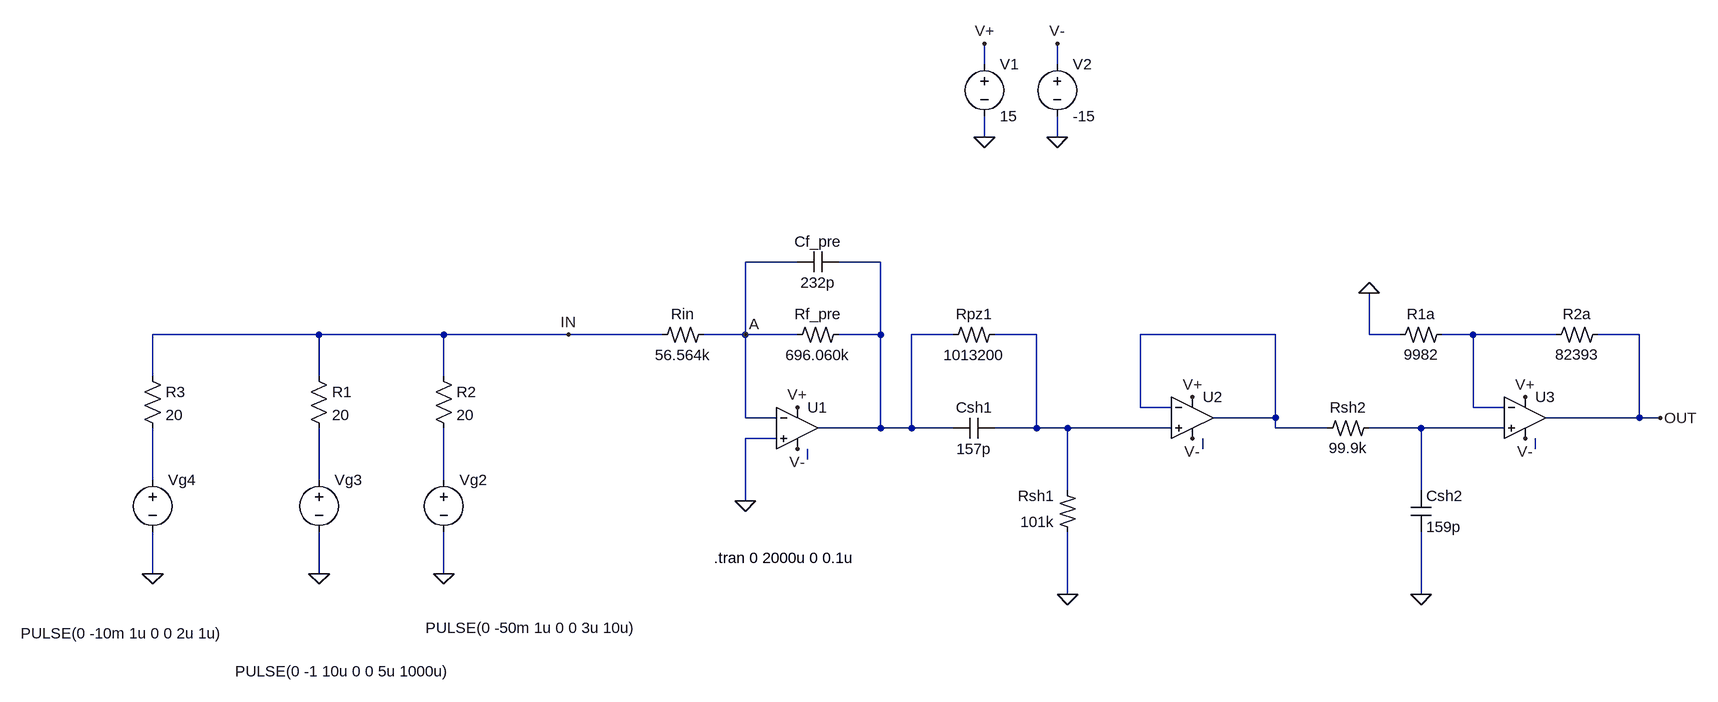
[diagram p0: schematic Catena_frequency.asc]
Catena_frequency.asc, the LTspice schematic file:
Version 4
SHEET 1 880 680
WIRE -448 -384 -448 -416
WIRE -336 -384 -336 -416
WIRE -448 -272 -448 -304
WIRE -336 -272 -336 -304
WIRE -736 -80 -816 -80
WIRE -608 -80 -672 -80
WIRE -1472 32 -1728 32
WIRE -1280 32 -1472 32
WIRE -1088 32 -1280 32
WIRE -944 32 -1088 32
WIRE -816 32 -816 -80
WIRE -816 32 -880 32
WIRE -736 32 -816 32
WIRE -608 32 -608 -80
WIRE -608 32 -672 32
WIRE -496 32 -560 32
WIRE -368 32 -432 32
WIRE 0 32 -208 32
WIRE 144 32 144 -32
WIRE 192 32 144 32
WIRE 304 32 256 32
WIRE 432 32 304 32
WIRE 560 32 496 32
WIRE -1728 96 -1728 32
WIRE -1472 96 -1472 32
WIRE -1280 96 -1280 32
WIRE -208 144 -208 32
WIRE -160 144 -208 144
WIRE 304 144 304 32
WIRE 352 144 304 144
WIRE -816 160 -816 32
WIRE -768 160 -816 160
WIRE 0 160 0 32
WIRE 0 160 -96 160
WIRE 560 160 560 32
WIRE 560 160 416 160
WIRE 592 160 560 160
WIRE -608 176 -608 32
WIRE -608 176 -704 176
WIRE -560 176 -560 32
WIRE -560 176 -608 176
WIRE -496 176 -560 176
WIRE -368 176 -368 32
WIRE -368 176 -432 176
WIRE -320 176 -368 176
WIRE -160 176 -320 176
WIRE 0 176 0 160
WIRE 80 176 0 176
WIRE 224 176 144 176
WIRE 352 176 224 176
WIRE -768 192 -816 192
WIRE -112 208 -112 192
WIRE 400 208 400 192
WIRE -720 224 -720 208
WIRE -1728 256 -1728 176
WIRE -1472 256 -1472 176
WIRE -1280 256 -1280 176
WIRE -320 272 -320 176
WIRE 224 272 224 176
WIRE -816 288 -816 192
WIRE -1728 400 -1728 336
WIRE -1472 400 -1472 336
WIRE -1280 400 -1280 336
WIRE -320 432 -320 336
WIRE 224 432 224 336
FLAG -448 -272 0
FLAG -336 -272 0
FLAG -448 -416 V+
FLAG -336 -416 V-
FLAG -816 288 0
FLAG -736 208 V-
FLAG -736 144 V+
FLAG -816 32 A
FLAG -128 192 V-
FLAG -128 128 V+
FLAG -320 432 0
FLAG 224 432 0
FLAG 384 192 V-
FLAG 384 128 V+
FLAG 144 -32 0
FLAG 592 160 OUT
FLAG -1088 32 IN
FLAG -1280 400 0
FLAG -1472 400 0
FLAG -1728 400 0
SYMBOL voltage -448 -400 R0
WINDOW 123 24 126 Left 2
WINDOW 39 24 111 Left 2
SYMATTR InstName V1
SYMATTR Value 15
SYMBOL voltage -336 -400 R0
WINDOW 123 24 126 Left 2
WINDOW 39 24 111 Left 2
SYMATTR InstName V2
SYMATTR Value -15
SYMBOL Opamps/UniversalOpamp2 -736 176 R0
SYMATTR InstName U1
SYMBOL res2 -880 16 R90
WINDOW 0 0 32 VBottom 2
WINDOW 3 32 32 VTop 2
SYMATTR InstName Rin
SYMATTR Value 56.564k
SYMBOL res2 -672 16 R90
WINDOW 0 0 32 VBottom 2
WINDOW 3 32 32 VTop 2
SYMATTR InstName Rf_pre
SYMATTR Value 696.060k
SYMBOL cap -672 -96 R90
WINDOW 0 0 32 VBottom 2
WINDOW 3 32 32 VTop 2
SYMATTR InstName Cf_pre
SYMATTR Value 232p
SYMBOL Opamps/UniversalOpamp2 -128 160 R0
SYMATTR InstName U2
SYMBOL cap -432 160 R90
WINDOW 0 0 32 VBottom 2
WINDOW 3 32 32 VTop 2
SYMATTR InstName Csh1
SYMATTR Value 157p
SYMBOL res2 -304 336 R180
WINDOW 0 36 56 Left 2
WINDOW 3 36 16 Left 2
SYMATTR InstName Rsh1
SYMATTR Value 101k
SYMBOL res2 144 160 R90
WINDOW 0 0 32 VBottom 2
WINDOW 3 31 32 VTop 2
SYMATTR InstName Rsh2
SYMATTR Value 99.9k
SYMBOL cap 208 272 R0
SYMATTR InstName Csh2
SYMATTR Value 159p
SYMBOL res2 -432 16 R90
WINDOW 0 0 32 VBottom 2
WINDOW 3 32 32 VTop 2
SYMATTR InstName Rpz1
SYMATTR Value 1013200
SYMBOL Opamps/UniversalOpamp2 384 160 R0
SYMATTR InstName U3
SYMBOL res2 256 16 R90
WINDOW 0 0 32 VBottom 2
WINDOW 3 31 32 VTop 2
SYMATTR InstName R1a
SYMATTR Value 9982
SYMBOL res2 496 16 R90
WINDOW 0 0 32 VBottom 2
WINDOW 3 31 32 VTop 2
SYMATTR InstName R2a
SYMATTR Value 82393
SYMBOL voltage -1280 240 R0
WINDOW 3 -28 243 Left 2
WINDOW 123 0 0 Left 0
WINDOW 39 0 0 Left 0
SYMATTR Value PULSE(0 -50m 1u 0 0 3u 10u)
SYMATTR InstName Vg2
SYMBOL voltage -1472 240 R0
WINDOW 3 -129 310 Left 2
WINDOW 123 0 0 Left 0
WINDOW 39 0 0 Left 0
SYMATTR Value PULSE(0 -1 10u 0 0 5u 1000u)
SYMATTR InstName Vg3
SYMBOL res -1488 80 R0
SYMATTR InstName R1
SYMATTR Value 20
SYMBOL res -1296 80 R0
SYMATTR InstName R2
SYMATTR Value 20
SYMBOL voltage -1728 240 R0
WINDOW 3 -203 252 Left 2
WINDOW 123 0 0 Left 0
WINDOW 39 0 0 Left 0
SYMATTR Value PULSE(0 -10m 1u 0 0 2u 1u)
SYMATTR InstName Vg4
SYMBOL res -1744 80 R0
SYMATTR InstName R3
SYMATTR Value 20
TEXT -864 376 Left 2 !.tran 0 2000u 0 0.1u

The netlist it stands for:
* Catena_frequency.asc
V1 V+ 0 15
V2 V- 0 -15
XU1 0 A V+ V- N001 level.2 Avol=1Meg GBW=10Meg Slew=10Meg ilimit=25m rail=0 Vos=0 phimargin=45 en=0 enk=0 in=0 ink=0 Rin=500Meg  ; pins IN+ IN- V+ V- OUT
Rin A IN 56.564k
Rf_pre N001 A 696.060k
Cf_pre N001 A 232p
XU2 N002 N003 V+ V- N003 level.2 Avol=1Meg GBW=10Meg Slew=10Meg ilimit=25m rail=0 Vos=0 phimargin=45 en=0 enk=0 in=0 ink=0 Rin=500Meg  ; pins IN+ IN- V+ V- OUT
Csh1 N002 N001 157p
Rsh1 0 N002 101k
Rsh2 N005 N003 99.9k
Csh2 N005 0 159p
Rpz1 N002 N001 1013200
XU3 N005 N004 V+ V- OUT level.2 Avol=1Meg GBW=10Meg Slew=10Meg ilimit=25m rail=0 Vos=0 phimargin=45 en=0 enk=0 in=0 ink=0 Rin=500Meg  ; pins IN+ IN- V+ V- OUT
R1a N004 0 9982
R2a OUT N004 82393
Vg2 N011 0 PULSE(0 -50m 1u 0 0 3u 10u)
Vg3 N010 0 PULSE(0 -1 10u 0 0 5u 1000u)
R1 IN N010 20
R2 IN N011 20
Vg4 N009 0 PULSE(0 -10m 1u 0 0 2u 1u)
R3 IN N009 20
.tran 0 2000u 0 0.1u
.lib UniversalOpamps2.sub
.backanno
.end